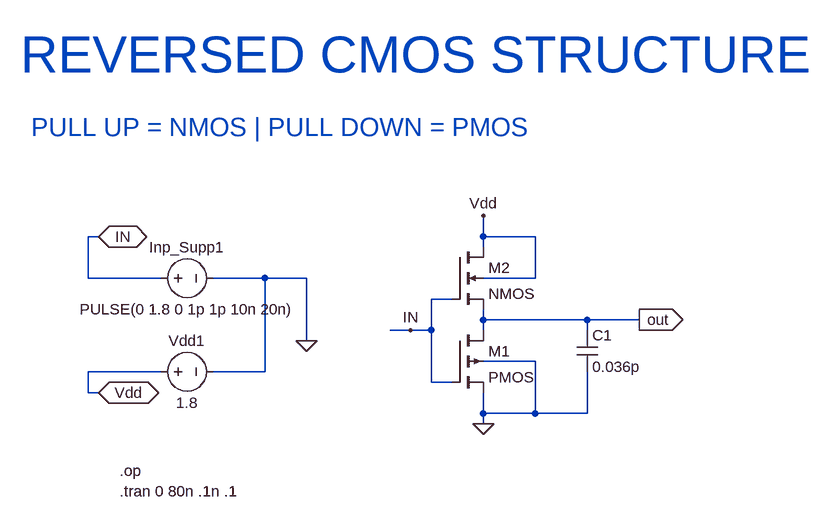
[diagram p0: schematic reversed_cmos.asc]
reversed_cmos.asc, the LTspice schematic file:
Version 4
SHEET 1 884 680
WIRE -144 192 -160 192
WIRE 448 192 448 160
WIRE 528 192 448 192
WIRE 448 208 448 192
WIRE -160 256 -160 192
WIRE -48 256 -160 256
WIRE 112 256 32 256
WIRE 176 256 112 256
WIRE 528 256 528 192
WIRE 528 256 448 256
WIRE 400 288 368 288
WIRE 448 320 448 304
WIRE 608 320 448 320
WIRE 688 320 608 320
WIRE 336 336 304 336
WIRE 368 336 368 288
WIRE 368 336 336 336
WIRE 448 336 448 320
WIRE 608 336 608 320
WIRE 176 352 176 256
WIRE 528 384 448 384
WIRE -48 400 -160 400
WIRE 112 400 112 256
WIRE 112 400 32 400
WIRE 368 416 368 336
WIRE 400 416 368 416
WIRE -160 432 -160 400
WIRE -144 432 -160 432
WIRE 448 464 448 432
WIRE 528 464 528 384
WIRE 528 464 448 464
WIRE 608 464 608 400
WIRE 608 464 528 464
WIRE 448 480 448 464
FLAG 448 480 0
FLAG 688 320 out
IOPIN 688 320 Out
FLAG 176 352 0
FLAG -144 192 IN
IOPIN -144 192 BiDir
FLAG -144 432 Vdd
IOPIN -144 432 BiDir
FLAG 336 336 IN
FLAG 448 160 Vdd
SYMBOL pmos4 400 336 R0
SYMATTR InstName M1
SYMATTR Value2 l=180n w=2u
SYMBOL nmos4 400 208 R0
SYMATTR InstName M2
SYMATTR Value2 l=180n w=1u
SYMBOL cap 592 336 R0
SYMATTR InstName C1
SYMATTR Value 0.036p
SYMBOL voltage -64 256 R270
WINDOW 0 32 56 VTop 2
WINDOW 3 -32 56 VBottom 2
SYMATTR InstName Inp_Supp1
SYMATTR Value PULSE(0 1.8 0 1p 1p 10n 20n)
SYMBOL voltage -64 400 R270
WINDOW 0 32 56 VTop 2
WINDOW 3 -32 56 VBottom 2
SYMATTR InstName Vdd1
SYMATTR Value 1.8
TEXT -264 -88 Left 6 ;REVERSED CMOS STRUCTURE
TEXT -248 24 Left 4 ;PULL UP = NMOS | PULL DOWN = PMOS
TEXT -112 552 Left 2 !.op
TEXT -112 584 Left 2 !.tran 0 80n .1n .1

The netlist it stands for:
* reversed_cmos.asc
M1 out IN 0 0 PMOS l=180n w=2u
M2 Vdd IN out Vdd NMOS l=180n w=1u
C1 out 0 0.036p
V§Inp_Supp1 IN 0 PULSE(0 1.8 0 1p 1p 10n 20n)
Vdd1 Vdd 0 1.8
.model NMOS NMOS
.model PMOS PMOS
.lib standard.mos
* REVERSED CMOS STRUCTURE
* PULL UP = NMOS | PULL DOWN = PMOS
.op
.tran 0 80n .1n .1
.backanno
.end

* Results of the author's LTspice run, read from the files saved beside the schematic
* Operating Point, zero values left out:
*   V(out) = 900 mV
*   V(vdd) = 1.8 V
*   Ib(M2) = 12.93 A
*   Is(M2) = -12.93 A
*   Id(M1) = 12.93 A
*   Ib(M1) = -12.93 A
*   Is(M1) = -90 µA
*   I(Vdd1) = -12.93 A
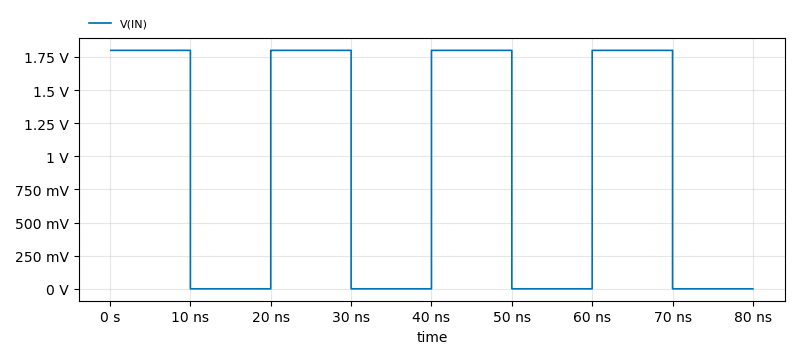
[diagram p1: Transient Analysis of reversed_cmos.asc, plotted from the saved traces]
* Transient Analysis, 1 run:
*   V(IN): min 0 V, max 1.8 V, average 899 mV, rms 1.272 V, last 0 V